# Altium project Localisation_board.PrjPCB
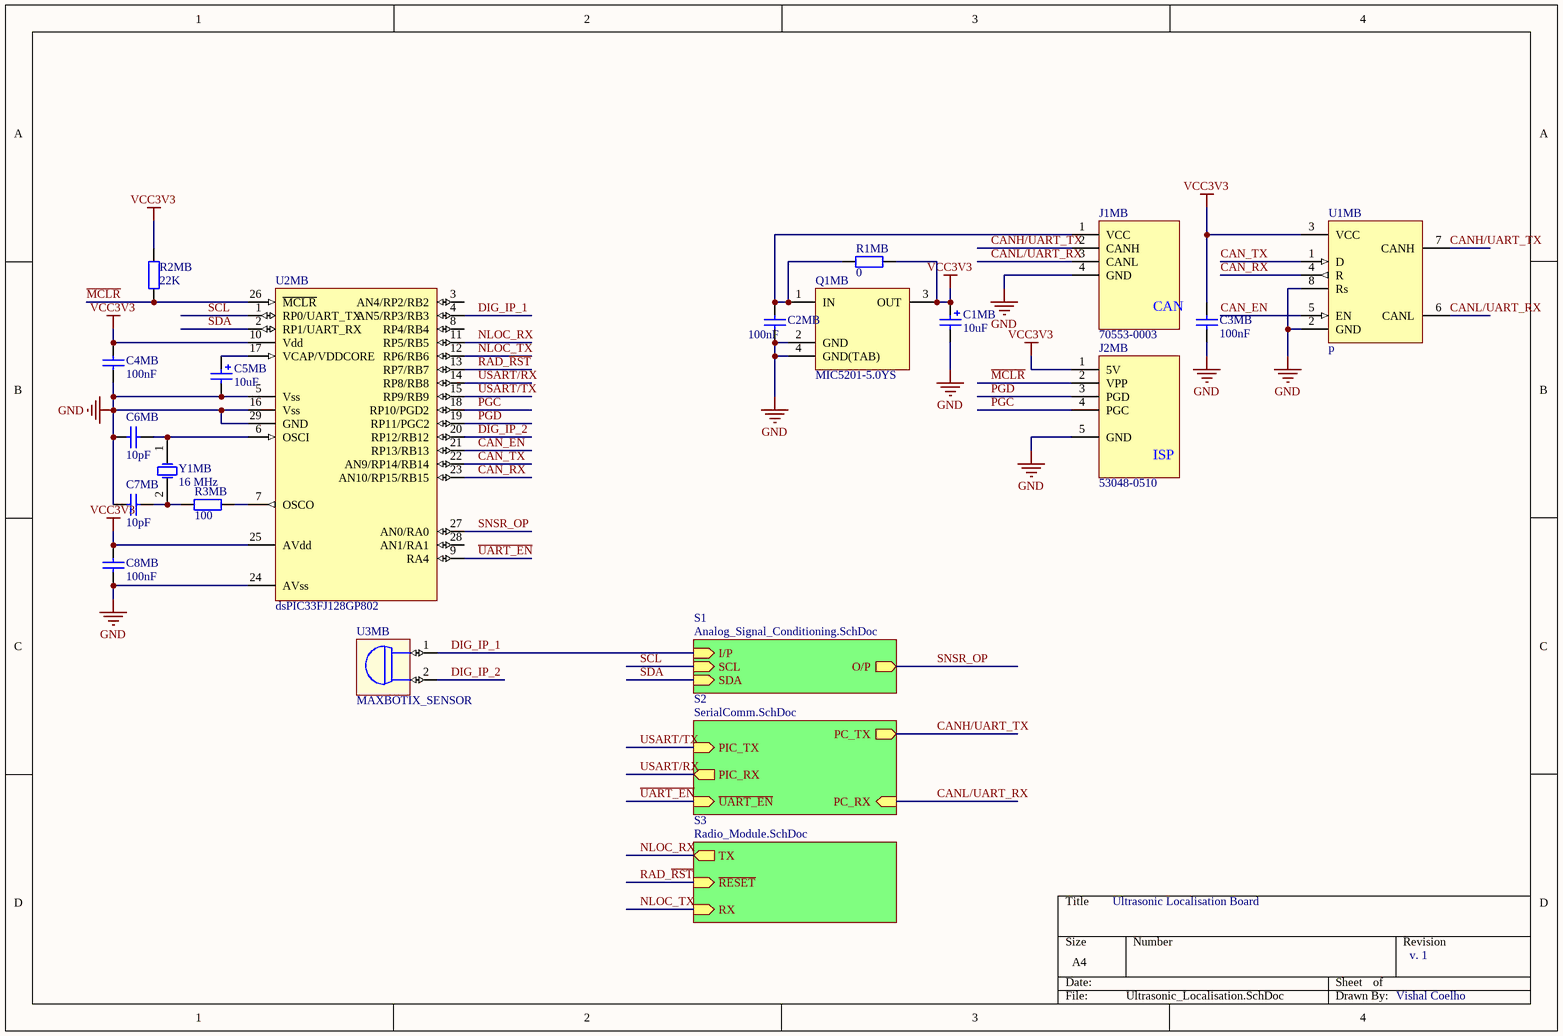
[diagram p0: Ultrasonic_Localisation.SchDoc]
4 sheets, 51 parts. Net scope: hierarchical (ports join the sheet entries above them; power ports are global).
Board file: Ultrasonic_Localisation.PcbDoc
Sheets:
  Ultrasonic_Localisation.SchDoc
    S1 = Analog_Signal_Conditioning.SchDoc
    S2 = SerialComm.SchDoc
    S3 = Radio_Module.SchDoc

## Sheet Ultrasonic_Localisation.SchDoc
size A4

### Parts
C1MB  value 10uF  [TC3528-1411]  (hidden comment: TPSB106K016R0800)
C2MB  value 100nF  [CC1608-0603]  (hidden comment: UMK107BJ104KA-T)
C3MB  value 100nF  [CC1608-0603]  (hidden comment: UMK107BJ104KA-T)
C4MB  value 100nF  [CC1608-0603]  (hidden comment: UMK107BJ104KA-T)
C5MB  value 10uF  [TC3528-1411]  (hidden comment: TPSB106K016R0800)
C6MB  value 10pF  [CC1608-0603]  (hidden comment: Cap)
C7MB  value 10pF  [CC1608-0603]  (hidden comment: Cap)
C8MB  value 100nF  [CC1608-0603]  (hidden comment: UMK107BJ104KA-T)
J1MB  70553-0003  [CON_CAN_Device-4]
J2MB  53048-0510  [CON_ISP]
Q1MB  MIC5201-5.0YS  [DSO-G3]
R1MB  value 0  [CR1608-0603]  (hidden comment: Res)
R2MB  value 22K  [CR1608-0603]  (hidden comment: Res)
R3MB  value 100  [CR1608-0603]  (hidden comment: Res)
U1MB  p  [SO-G8/E2.9]
U2MB  dsPIC33FJ128GP802  [QFN6X6-28]
U3MB  MAXBOTIX_SENSOR  [Maxbotix Sensor]
Y1MB  value 16 MHz  [CS10]  (hidden comment: CS10-16.000MABJ-UT)

### Sub-sheets
S1 = Analog_Signal_Conditioning.SchDoc: I/P (in), O/P (out), SCL (in), SDA (in)
S2 = SerialComm.SchDoc: PIC_RX (out), PC_RX (in), PC_TX (out), PIC_TX (in), ~{UART_EN} (in)
S3 = Radio_Module.SchDoc: TX (out), RX (in), ~{RESET} (in)

### Nets
GND: C1MB.2 C2MB.2 C3MB.2 C4MB.2 C5MB.2 C6MB.1 C7MB.1 C8MB.2 J1MB.4(GND) J2MB.5(GND) Q1MB.2(GND) Q1MB.4(GND(TAB)) U1MB.2(GND) U1MB.8(Rs) U2MB.5(Vss) U2MB.16(Vss) U2MB.24(AVss) U2MB.29(GND)
VCC3V3: C1MB.1 C3MB.1 C4MB.1 C8MB.1 J2MB.1(5V) Q1MB.3(OUT) R1MB.1 R2MB.2 U1MB.3(VCC) U2MB.10(Vdd) U2MB.25(AVdd)
CAN_EN: U1MB.5(EN) U2MB.21(RP13/RB13)
CAN_RX: U1MB.4(R) U2MB.23(AN10/RP15/RB15)
CAN_TX: U1MB.1(D) U2MB.22(AN9/RP14/RB14)
CANH/UART_TX: J1MB.2(CANH) U1MB.7(CANH) ; sheet S2/PC_TX
CANL/UART_RX: J1MB.3(CANL) U1MB.6(CANL) ; sheet S2/PC_RX
DIG_IP_1: U2MB.4(AN5/RP3/RB3) U3MB.1(SNSR_1) ; sheet S1/I/P
DIG_IP_2: U2MB.20(RP12/RB12) U3MB.2(SNSR_2)
~{MCLR}: J2MB.2(VPP) R2MB.1 U2MB.26(~{MCLR})
NLOC_RX: U2MB.11(RP5/RB5) ; sheet S3/TX
NLOC_TX: U2MB.12(RP6/RB6) ; sheet S3/RX
PGC: J2MB.4(PGC) U2MB.18(RP10/PGD2)
PGD: J2MB.3(PGD) U2MB.19(RP11/PGC2)
RAD_~{RST}: U2MB.13(RP7/RB7) ; sheet S3/~{RESET}
SCL: U2MB.1(RP0/UART_TX) ; sheet S1/SCL
SDA: U2MB.2(RP1/UART_RX) ; sheet S1/SDA
SNSR_OP: U2MB.27(AN0/RA0) ; sheet S1/O/P
~{UART_EN}: U2MB.9(RA4) ; sheet S2/~{UART_EN}
USART/RX: U2MB.14(RP8/RB8) ; sheet S2/PIC_RX
USART/TX: U2MB.15(RP9/RB9) ; sheet S2/PIC_TX
NetC2MB_1: C2MB.1 J1MB.1(VCC) Q1MB.1(IN) R1MB.2
NetC5MB_1: C5MB.1 U2MB.17(VCAP/VDDCORE)
NetC6MB_2: C6MB.2 U2MB.6(OSCI) Y1MB.1(OSC1)
NetC7MB_2: C7MB.2 R3MB.2 Y1MB.2(OSC2)
NetR3MB_1: R3MB.1 U2MB.7(OSCO)

Not connected (* = marked no-connect by the designer): U2MB 3(AN4/RP2/RB2) 8(RP4/RB4) 28(AN1/RA1)

### Notes on the sheet
- Ultrasonic Localisation Board
- v. 1
- Vishal Coelho
- (in symbol CON_CAN_DEVICE) CAN
- (in symbol CON_ISP_Header_5p_1.25mm_horizontal) ISP

### Library data of the parts
C1MB C5MB = Cap Pol: Polarized Capacitor (Surface Mount); Manufacturer: AVX; Distributor: Digikey; OrderCode: TPSB106K016R0800
C2MB C3MB C4MB C8MB = Cap: Capacitor; Manufacturer: Taiyo Yuden; Distributor: Digikey; OrderCode: UMK107BJ104KA-T
C6MB C7MB = Cap: Capacitor; Manufacturer: Panasonic; OrderCode: ECJ-1VC1H100D; Distributor: Digikey
J1MB = CON_CAN_DEVICE: 4 pin CAN Connector 2.54mm pitch; Manufacturer: Molex; Distributor: Digikey; OrderCode: 70553-0003
J2MB = CON_ISP_Header_5p_1.25mm_horizontal: 6 pin header - 1.25mm pitch horizontal; Manufacturer: Molex; OrderCode: 53048-0510 + 51021-0500 + 5 x 50079-8000; Distributor: Digikey
Q1MB = MIC5201-5.0YS: 5V LDO 200mA; Manufacturer: Micrel; OrderCode: MIC5201-3.3YS TR; Distributor: Digikey
R1MB R2MB R3MB = Res: Resistor; Distributor: Digikey
U1MB = SN65HVD234D: 3.3V CAN Transceiver; Manufacturer: Texas Instruments; Distributor: Digikey; OrderCode: SN65HVD234D
U2MB = dsPIC33FJ128GP802: dsPIC33FJ128GP802 with 2 UART's; Manufacturer: MicroChip; OrderCode: *
U3MB = MAXBOTIX_SENSOR: Maxbotix Ultrasonic Sensor; Distibutor: *; Manufacturer: Maxbotix; OrderCode: *
Y1MB = CS10: Crystal Oscillator; Manufacturer: Citizen; Distributor: Digikey; OrderCode: CS10-16.000MABJ-UT

## Sheet Analog_Signal_Conditioning.SchDoc
size A
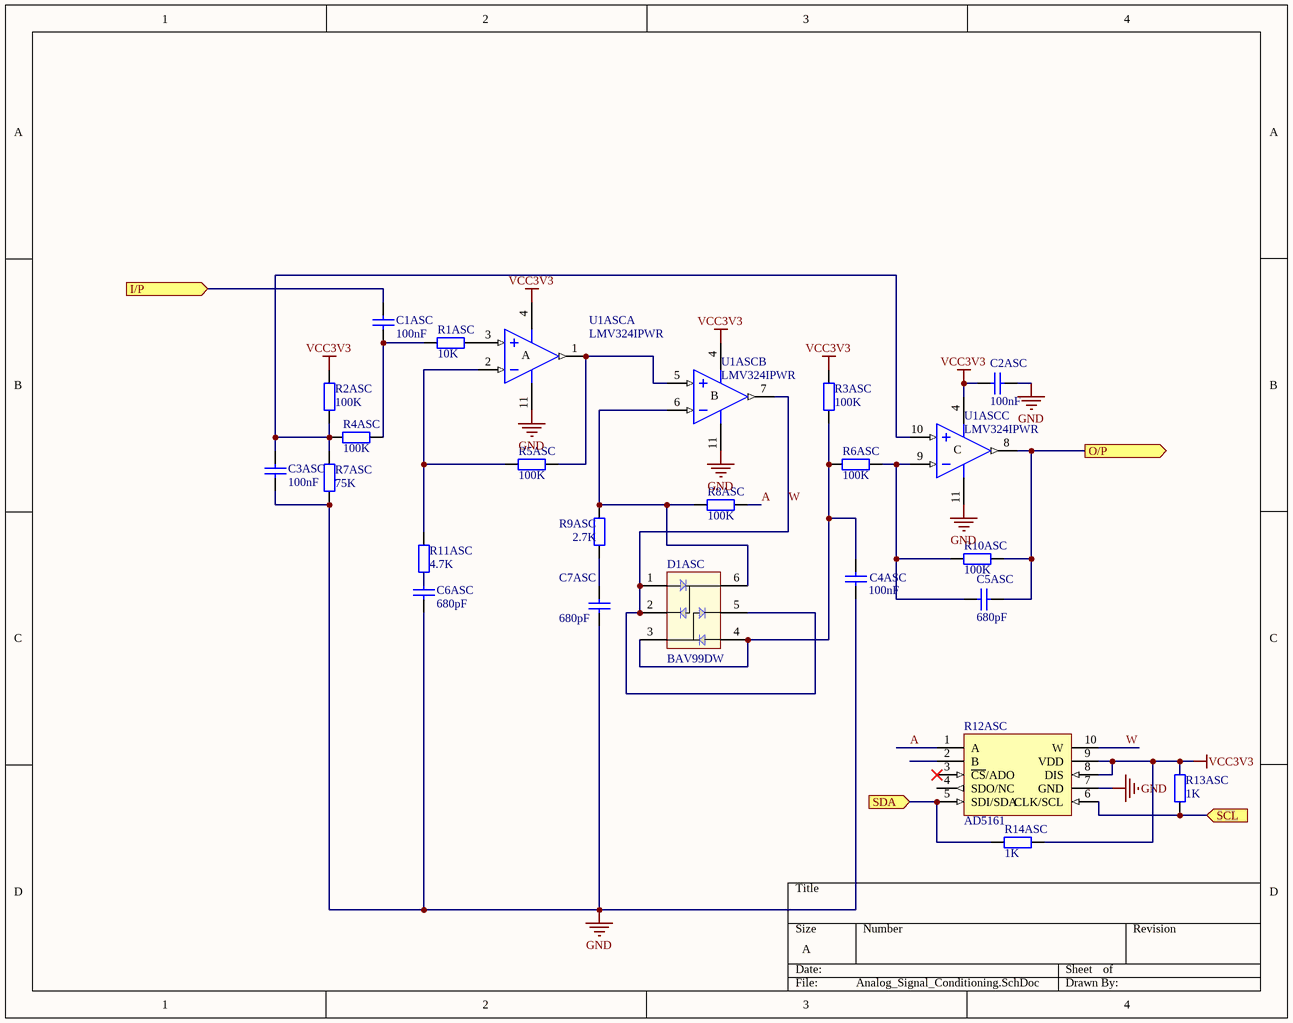
[diagram p1: Analog_Signal_Conditioning.SchDoc]

### Parts
C1ASC  value 100nF  [CC1608-0603]  (hidden comment: Cap)
C2ASC  value 100nF  [CC1608-0603]  (hidden comment: Cap)
C3ASC  value 100nF  [CC1608-0603]  (hidden comment: Cap)
C4ASC  value 100nF  [CC1608-0603]  (hidden comment: Cap)
C5ASC  value 680pF  [CC1608-0603]  (hidden comment: Cap)
C6ASC  value 680pF  [CC1608-0603]  (hidden comment: Cap)
C7ASC  value 680pF  [CC1608-0603]  (hidden comment: Cap)
D1ASC  BAV99DW-7-F  [SOT-323-6L]  (value not drawn)
R1ASC  value 10K  [CR1608-0603]  (hidden comment: Res)
R2ASC  value 100K  [CR1608-0603]  (hidden comment: Res)
R3ASC  value 100K  [CR1608-0603]  (hidden comment: Res)
R4ASC  value 100K  [CR1608-0603]  (hidden comment: Res)
R5ASC  value 100K  [CR1608-0603]  (hidden comment: Res)
R6ASC  value 100K  [CR1608-0603]  (hidden comment: Res)
R7ASC  value 75K  [CR1608-0603]  (hidden comment: Res)
R8ASC  value 100K  [CR1608-0603]  (hidden comment: Res)
R9ASC  value 2.7K  [CR1608-0603]  (hidden comment: Res)
R10ASC  value 100K  [CR1608-0603]  (hidden comment: Res)
R11ASC  value 4.7K  [CR1608-0603]  (hidden comment: Res)
R12ASC  AD5161  [TSSO3x5-G10]
R13ASC  value 1K  [CR1608-0603]  (hidden comment: Res)
R14ASC  value 1K  [CR1608-0603]  (hidden comment: Res)
U1ASC  LMV324IPWR  [TSSO5x6-G14/X.3]  (parts A,B,C of 4)

### Ports
I/P (in), O/P (out), SCL (in), SDA (in)

### Nets
GND: C2ASC.1 C3ASC.1 C4ASC.1 C6ASC.1 C7ASC.1 R7ASC.1 R12ASC.7(GND) U1ASC.11(V-)
VCC3V3: C2ASC.2 R2ASC.2 R3ASC.2 R12ASC.8(DIS) R12ASC.9(VDD) R13ASC.2 R14ASC.1 U1ASC.4(V+)
A: R8ASC.2 R12ASC.1(A)
DIG_IP_1: C1ASC.2 ; port I/P
SCL: R12ASC.6(CLK/SCL) R13ASC.1 ; port SCL
SDA: R12ASC.5(SDI/SDA) R14ASC.2 ; port SDA
SNSR_OP: C5ASC.1 R10ASC.1 U1ASC.8(OUT) ; port O/P
W: D1ASC.1(A1) D1ASC.2(C1) D1ASC.5(C2) R12ASC.10(W) U1ASC.7(OUT)
NetC1ASC_1: C1ASC.1 R1ASC.2 R4ASC.1
NetC3ASC_2: C3ASC.2 R2ASC.1 R4ASC.2 R7ASC.2 U1ASC.10(IN+)
NetC4ASC_2: C4ASC.2 D1ASC.3(AC2) D1ASC.4(A2) R3ASC.1 R6ASC.2
NetC5ASC_2: C5ASC.2 R6ASC.1 R10ASC.2 U1ASC.9(IN-)
NetC6ASC_2: C6ASC.2 R11ASC.2
NetC7ASC_2: C7ASC.2 R9ASC.1
NetD1ASC_6: D1ASC.6(AC1) R8ASC.1 R9ASC.2 U1ASC.6(IN-)
NetR1ASC_1: R1ASC.1 U1ASC.3(IN+)
NetR5ASC_1: R5ASC.1 U1ASC.1(OUT) U1ASC.5(IN+)
NetR5ASC_2: R5ASC.2 R11ASC.1 U1ASC.2(IN-)

Not connected (* = marked no-connect by the designer): R12ASC 2(B) 3(~{CS}/ADO)* 4(SDO/NC)

### Notes on the sheet
- (in symbol LMV324IPWR, part A) A
- (in symbol LMV324IPWR, part B) B
- (in symbol LMV324IPWR, part C) C

### Library data of the parts
C1ASC C2ASC C3ASC C4ASC C5ASC C6ASC C7ASC = Cap: Capacitor
D1ASC = BAV99DW: Quad surface mount switching diode array; Manufacturer: Diodes Incorporated; Distributor: DigiKey; OrderCode: BAV99DW-7-F
R1ASC R2ASC R3ASC R4ASC R5ASC R6ASC R7ASC R8ASC R9ASC R10ASC R11ASC R13ASC R14ASC = Res: Resistor; Distributor: Digikey
R12ASC = AD5161_3x5: AD5161 SPI/I2C Selectable Digital Potentiometer; Manufacturer: Analog Devices; OrderCode: AD5161BRMZ50-ND; Distributor: Digikey
U1ASC = LMV324IPWR: Rail-to-Rail Operational Amplifier; Manufacturer: Texas Instruments; Distributor: Digikey; OrderCode: LMV324IPWR

## Sheet SerialComm.SchDoc
size A
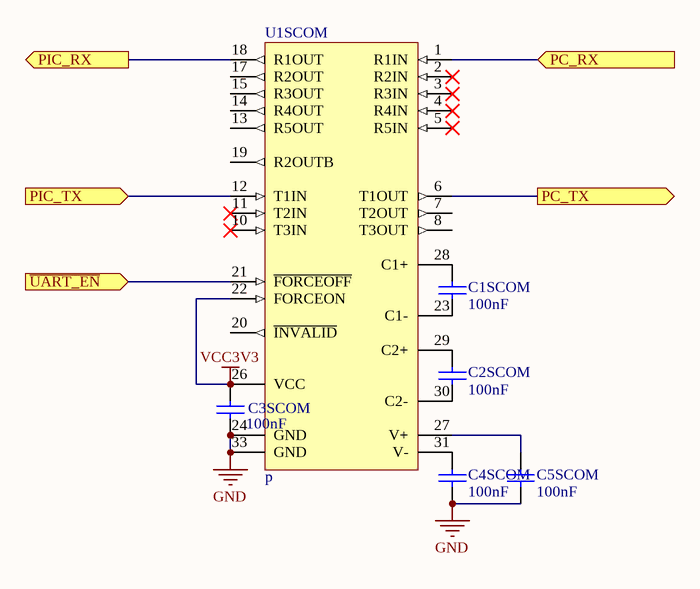
[diagram p2: SerialComm.SchDoc]

### Parts
C1SCOM  value 100nF  [CC1608-0603]  (hidden comment: UMK107BJ104KA-T)
C2SCOM  value 100nF  [CC1608-0603]  (hidden comment: UMK107BJ104KA-T)
C3SCOM  value 100nF  [CC1608-0603]  (hidden comment: UMK107BJ104KA-T)
C4SCOM  value 100nF  [CC1608-0603]  (hidden comment: UMK107BJ104KA-T)
C5SCOM  value 100nF  [CC1608-0603]  (hidden comment: UMK107BJ104KA-T)
U1SCOM  p  [QFN5X5-32]

### Ports
PC_RX (in), PC_TX (out), PIC_RX (out), PIC_TX (in), ~{UART_EN} (in)

### Nets
GND: C3SCOM.2 C4SCOM.2 C5SCOM.2 U1SCOM.24(GND) U1SCOM.33(GND)
VCC3V3: C3SCOM.1 U1SCOM.22(FORCEON) U1SCOM.26(VCC)
CANH/UART_TX: U1SCOM.6(T1OUT) ; port PC_TX
CANL/UART_RX: U1SCOM.1(R1IN) ; port PC_RX
~{UART_EN}: U1SCOM.21(~{FORCEOFF}) ; port ~{UART_EN}
USART/RX: U1SCOM.18(R1OUT) ; port PIC_RX
USART/TX: U1SCOM.12(T1IN) ; port PIC_TX
NetC1SCOM_1: C1SCOM.1 U1SCOM.28(C1+)
NetC1SCOM_2: C1SCOM.2 U1SCOM.23(C1-)
NetC2SCOM_1: C2SCOM.1 U1SCOM.29(C2+)
NetC2SCOM_2: C2SCOM.2 U1SCOM.30(C2-)
NetC4SCOM_1: C4SCOM.1 U1SCOM.31(V-)
NetC5SCOM_1: C5SCOM.1 U1SCOM.27(V+)

Not connected (* = marked no-connect by the designer): U1SCOM 2(R2IN)* 3(R3IN)* 4(R4IN)* 5(R5IN)* 7(T2OUT) 8(T3OUT) 10(T3IN)* 11(T2IN)* 13(R5OUT) 14(R4OUT) 15(R3OUT) 17(R2OUT) 19(R2OUTB) 20(~{INVALID})

### Library data of the parts
C1SCOM C2SCOM C3SCOM C4SCOM C5SCOM = Cap: Capacitor; Manufacturer: Taiyo Yuden; Distributor: Digikey; OrderCode: UMK107BJ104KA-T
U1SCOM = MAX3243E_SMALL: RS232 Transceiver; Manufacturer: Texas Instruments; OrderCode: MAX3243EIRHBR; Distributor: Digikey

## Sheet Radio_Module.SchDoc
size A
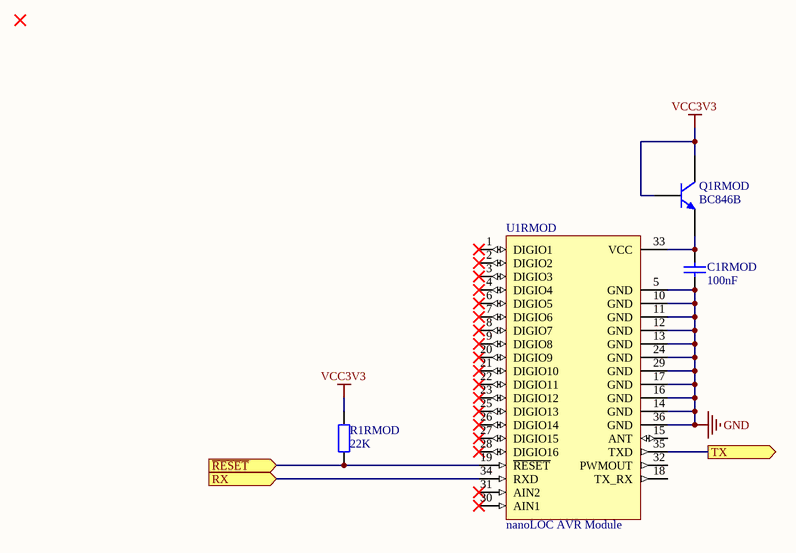
[diagram p3: Radio_Module.SchDoc]

### Parts
C1RMOD  value 100nF  [CC1608-0603]  (hidden comment: Cap)
Q1RMOD  BC846B  [SO-G3]
R1RMOD  value 22K  [CR1608-0603]  (hidden comment: Res)
U1RMOD  nanoLOC AVR Module  [nano_LOC_AVR_Module35x14]

### Ports
RX (in), TX (out), ~{RESET} (in)

### Nets
GND: C1RMOD.1 U1RMOD.5(GND) U1RMOD.10(GND) U1RMOD.11(GND) U1RMOD.12(GND) U1RMOD.13(GND) U1RMOD.14(GND) U1RMOD.16(GND) U1RMOD.17(GND) U1RMOD.24(GND) U1RMOD.29(GND) U1RMOD.36(GND)
VCC3V3: Q1RMOD.1(B) Q1RMOD.3(C) R1RMOD.2
NLOC_RX: U1RMOD.35(TXD) ; port TX
NLOC_TX: U1RMOD.34(RXD) ; port RX
RAD_~{RST}: R1RMOD.1 U1RMOD.19(~{RESET}) ; port ~{RESET}
NetC1RMOD_2: C1RMOD.2 Q1RMOD.2(E) U1RMOD.33(VCC)

Not connected (* = marked no-connect by the designer): U1RMOD 1(DIGIO1)* 2(DIGIO2)* 3(DIGIO3)* 4(DIGIO4)* 6(DIGIO5)* 7(DIGIO6)* 8(DIGIO7)* 9(DIGIO8)* 15(ANT) 18(TX_RX) 20(DIGIO9)* 21(DIGIO10)* 22(DIGIO11)* 23(DIGIO12)* 25(DIGIO13)* 26(DIGIO14)* 27(DIGIO15)* 28(DIGIO16)* 30(AIN1)* 31(AIN2)* 32(PWMOUT)

### Library data of the parts
C1RMOD = Cap: Capacitor
Q1RMOD = BC846B: NPN Bipolar Transistor; Manufacturer: NXP; OrderCode: BC846B T/R; Distributor: Digikey
R1RMOD = Res: Resistor; Distributor: Digikey
U1RMOD = nanoLOC AVR Module: Radio Transceiver and Localisation module; Manufacturer: NanoTron Inc.; Distributor: *; OrderCode: *

## Nets that join several sheets
GND: Ultrasonic_Localisation (18 pins), Analog_Signal_Conditioning (8 pins), SerialComm (5 pins), Radio_Module (12 pins)
VCC3V3: Ultrasonic_Localisation (11 pins), Analog_Signal_Conditioning (8 pins), SerialComm (C3SCOM.1 U1SCOM.22 U1SCOM.26), Radio_Module (Q1RMOD.1 Q1RMOD.3 R1RMOD.2)
CANH/UART_TX: Ultrasonic_Localisation (J1MB.2 U1MB.7), SerialComm (U1SCOM.6)
CANL/UART_RX: Ultrasonic_Localisation (J1MB.3 U1MB.6), SerialComm (U1SCOM.1)
DIG_IP_1: Ultrasonic_Localisation (U2MB.4 U3MB.1), Analog_Signal_Conditioning (C1ASC.2)
NLOC_RX: Ultrasonic_Localisation (U2MB.11), Radio_Module (U1RMOD.35)
NLOC_TX: Ultrasonic_Localisation (U2MB.12), Radio_Module (U1RMOD.34)
RAD_~{RST}: Ultrasonic_Localisation (U2MB.13), Radio_Module (R1RMOD.1 U1RMOD.19)
SCL: Ultrasonic_Localisation (U2MB.1), Analog_Signal_Conditioning (R12ASC.6 R13ASC.1)
SDA: Ultrasonic_Localisation (U2MB.2), Analog_Signal_Conditioning (R12ASC.5 R14ASC.2)
SNSR_OP: Ultrasonic_Localisation (U2MB.27), Analog_Signal_Conditioning (C5ASC.1 R10ASC.1 U1ASC.8)
~{UART_EN}: Ultrasonic_Localisation (U2MB.9), SerialComm (U1SCOM.21)
USART/RX: Ultrasonic_Localisation (U2MB.14), SerialComm (U1SCOM.18)
USART/TX: Ultrasonic_Localisation (U2MB.15), SerialComm (U1SCOM.12)